# EAGLE design maddomat-slave (EAGLE 9.6.2)
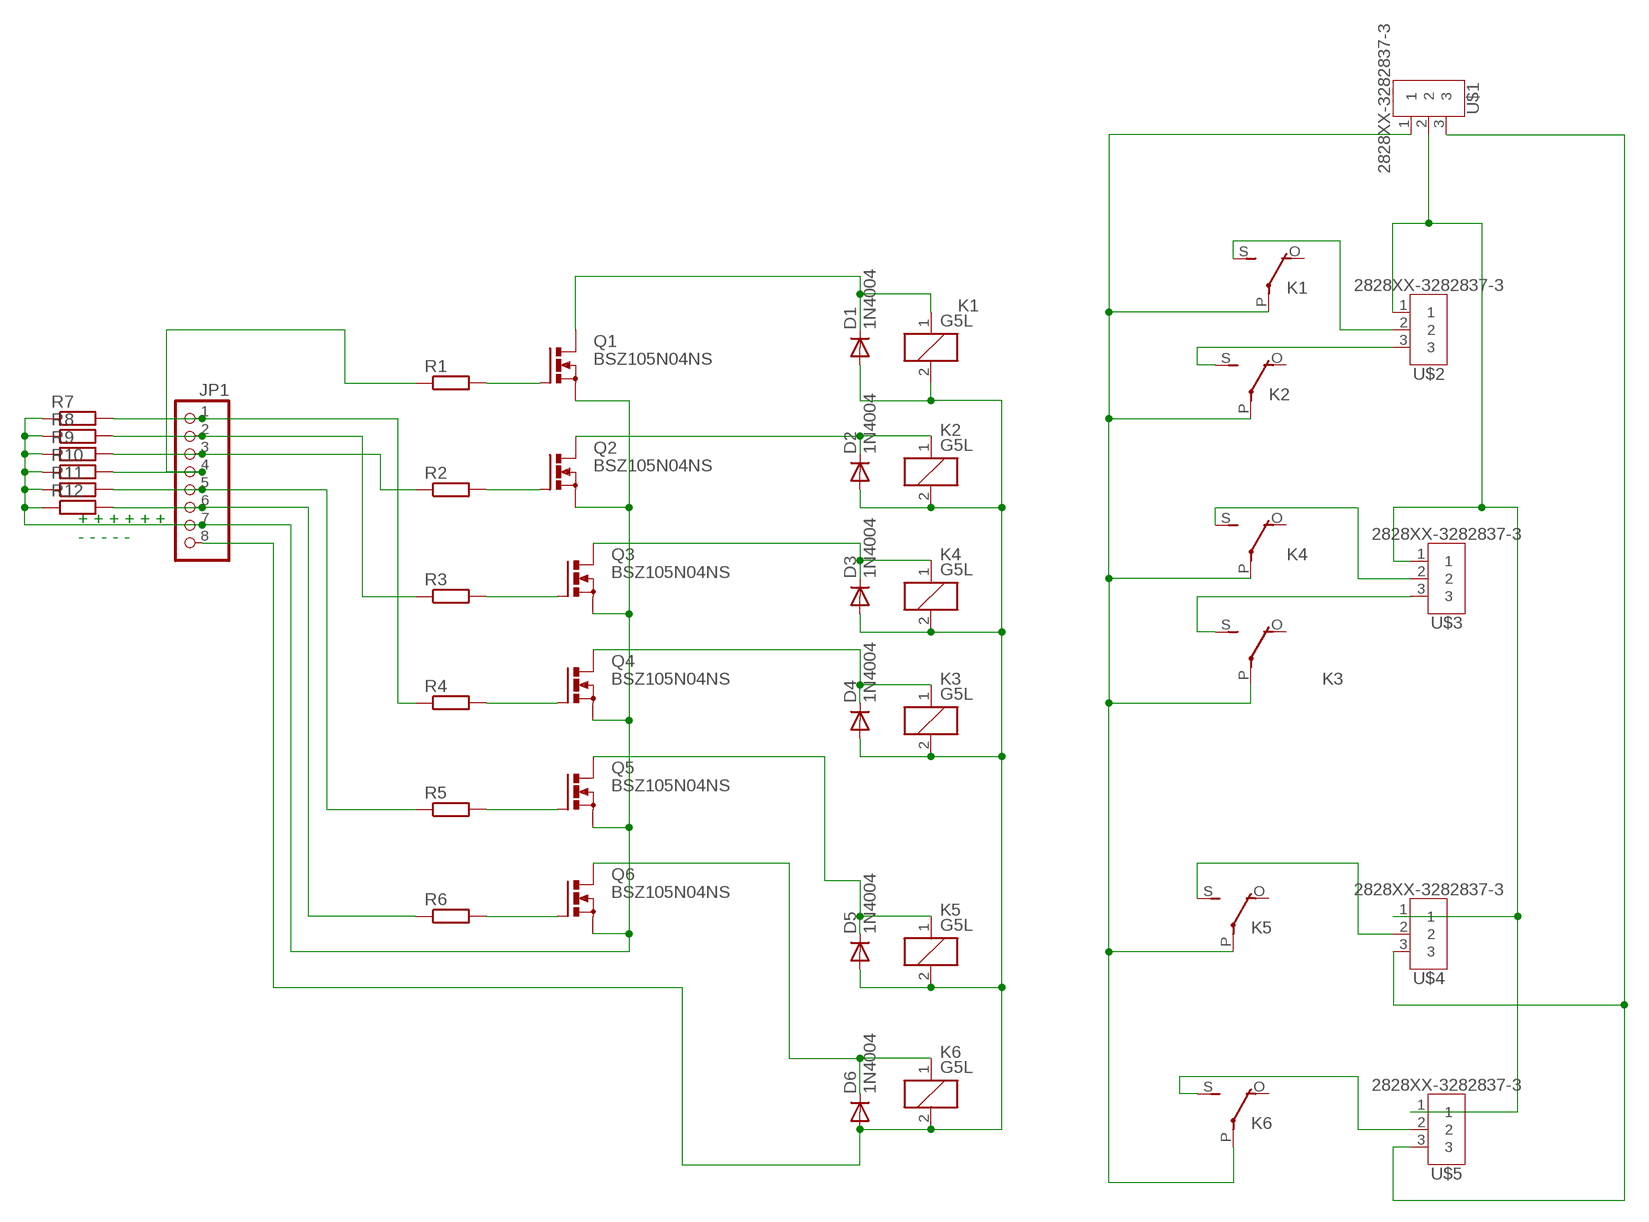
[diagram p0: schematic, sheet 1]

## Parts
D1  1N4004  [DO41-10]
D2  1N4004  [DO41-10]
D3  1N4004  [DO41-10]
D4  1N4004  [DO41-10]
D5  1N4004  [DO41-10]
D6  1N4004  [DO41-10]
JP1  PINHD-1X8  [1X08]
K1  G5L  [G5LE]
K2  G5L  [G5LE]
K3  G5L  [G5LE]
K4  G5L  [G5LE]
K5  G5L  [G5LE]
K6  G5L  [G5LE]
Q1  BSZ105N04NS  [PG-TDSON-8]
Q2  BSZ105N04NS  [PG-TDSON-8]
Q3  BSZ105N04NS  [PG-TDSON-8]
Q4  BSZ105N04NS  [PG-TDSON-8]
Q5  BSZ105N04NS  [PG-TDSON-8]
Q6  BSZ105N04NS  [PG-TDSON-8]
R1  R-EU_M0805  [M0805]
R2  R-EU_M0805  [M0805]
R3  R-EU_M0805  [M0805]
R4  R-EU_M0805  [M0805]
R5  R-EU_M0805  [M0805]
R6  R-EU_M0805  [M0805]
R7  R-EU_M0805  [M0805]
R8  R-EU_M0805  [M0805]
R9  R-EU_M0805  [M0805]
R10  R-EU_M0805  [M0805]
R11  R-EU_M0805  [M0805]
R12  R-EU_M0805  [M0805]
U$1  2828XX-3282837-3  [TERMBLK_508-3N]
U$2  2828XX-3282837-3  [TERMBLK_508-3N]
U$3  2828XX-3282837-3  [TERMBLK_508-3N]
U$4  2828XX-3282837-3  [TERMBLK_508-3N]
U$5  2828XX-3282837-3  [TERMBLK_508-3N]

## Nets
N$1: K1.S(2:S) U$2.2
N$2: K2.S(2:S) U$2.3
N$3: U$1.2 U$2.1 U$3.1 U$4.1 U$5.1
N$4: K4.S(2:S) U$3.2
N$5: K3.S(2:S) U$3.3
N$6: K5.S(2:S) U$4.2
N$7: K6.S(2:S) U$5.2
N$8: K1.P(2:P) K2.P(2:P) K3.P(2:P) K4.P(2:P) K5.P(2:P) K6.P(2:P) U$1.1
N$10: U$1.3 U$4.3 U$5.3
N$16: D1.C K1.1 Q1.5(D) Q1.6(D) Q1.7(D) Q1.8(D) Q1.TH(D)
N$17: JP1.4 R1.1 R10.2
N$18: JP1.3 R2.1 R9.2
N$19: JP1.2 R3.1 R8.2
N$20: JP1.1 R4.1 R7.2
N$21: JP1.5 R5.1 R11.2
N$22: JP1.6 R6.1 R12.2
N$23: Q1.4(G) R1.2
N$24: Q2.4(G) R2.2
N$25: Q3.4(G) R3.2
N$26: Q4.4(G) R4.2
N$27: Q5.4(G) R5.2
N$28: Q6.4(G) R6.2
N$32: JP1.7 Q1.1(S) Q1.2(S) Q1.3(S) Q2.1(S) Q2.2(S) Q2.3(S) Q3.1(S) Q3.2(S) Q3.3(S) Q4.1(S) Q4.2(S) Q4.3(S) Q5.1(S) Q5.2(S) Q5.3(S) Q6.1(S) Q6.2(S) Q6.3(S) R7.1 R8.1 R9.1 R10.1 R11.1 R12.1
N$36: D2.C K2.1 Q2.5(D) Q2.6(D) Q2.7(D) Q2.8(D) Q2.TH(D)
N$38: D3.C K4.1 Q3.5(D) Q3.6(D) Q3.7(D) Q3.8(D) Q3.TH(D)
N$39: D4.C K3.1 Q4.5(D) Q4.6(D) Q4.7(D) Q4.8(D) Q4.TH(D)
N$40: D5.C K5.1 Q5.5(D) Q5.6(D) Q5.7(D) Q5.8(D) Q5.TH(D)
N$41: D6.C K6.1 Q6.5(D) Q6.6(D) Q6.7(D) Q6.8(D) Q6.TH(D)
N$47: D1.A D2.A D3.A D4.A D5.A D6.A JP1.8 K1.2 K2.2 K3.2 K4.2 K5.2 K6.2
Unconnected: K1.O(2:O) K2.O(2:O) K3.O(2:O) K4.O(2:O) K5.O(2:O) K6.O(2:O)

## Notes on the sheet
- + + + + + +
- - - - - -

## Library data of the parts
D1-D6 = adafruit:1N4004: DIODE General purpose 1N400x type rectifier (With bigger pads) http://www.ladyada.net/library/pcb/eaglelibrary.html
JP1 = pinhead:PINHD-1X8: PIN HEADER
K1-K6 = relay:G5L: RELAY 1 x switch, 10 A/120 V AC, 8 A/30 V ADC, Omron; OC_FARNELL: unknown; OC_NEWARK: unknown
Q1-Q6 = transistor-power:BSZ105N04NS: OptiMOS (TM)3 Power-Transistor N-Channel, Normal level Source : Data sheet <http://www.infineon.com/dgdl/BSZ105N04NSG_rev1.1.pdf?folderId=db3a3043156fd5730115c7d50620107c&fileId=db3a30431689f4420116c485c67f084e>
R1-R12 = rcl_vlastni:R-EU_: RESISTOR, European symbol; SPICEPREFIX: R
U$1-U$5 = Connector:2828XX-3: 3 Position Wire to Board Terminal Block Horizontal with Board Datasheet <https://www.te.com.cn/commerce/DocumentDelivery/DDEController?Action=showdoc&DocId=Catalog+Section%7F1308389_EUROSTYLE_TERMINAL_BLOCKS%7F0607%7Fpdf%7FEnglish%7FENG_CS_1308389_EUROSTYLE_TERMINAL_BLOCKS_0607.pdf%7F2-282837-5>; CATEGORY: Connector; DESCRIPTION: TERM BLK 3P SIDE ENT 5.08mm PCB; MANUFACTURER: TE Connectivity; MPN: 282837-3; OPERATING_TEMPERATURE: -40°C to +105°C; PART_STATUS: Active; ROHS_COMPLIANCE: RoHS Compliant; SERIES: 282837; SUBCATEGORY: Terminal Block; TYPE: Side Wire Entry

## Board
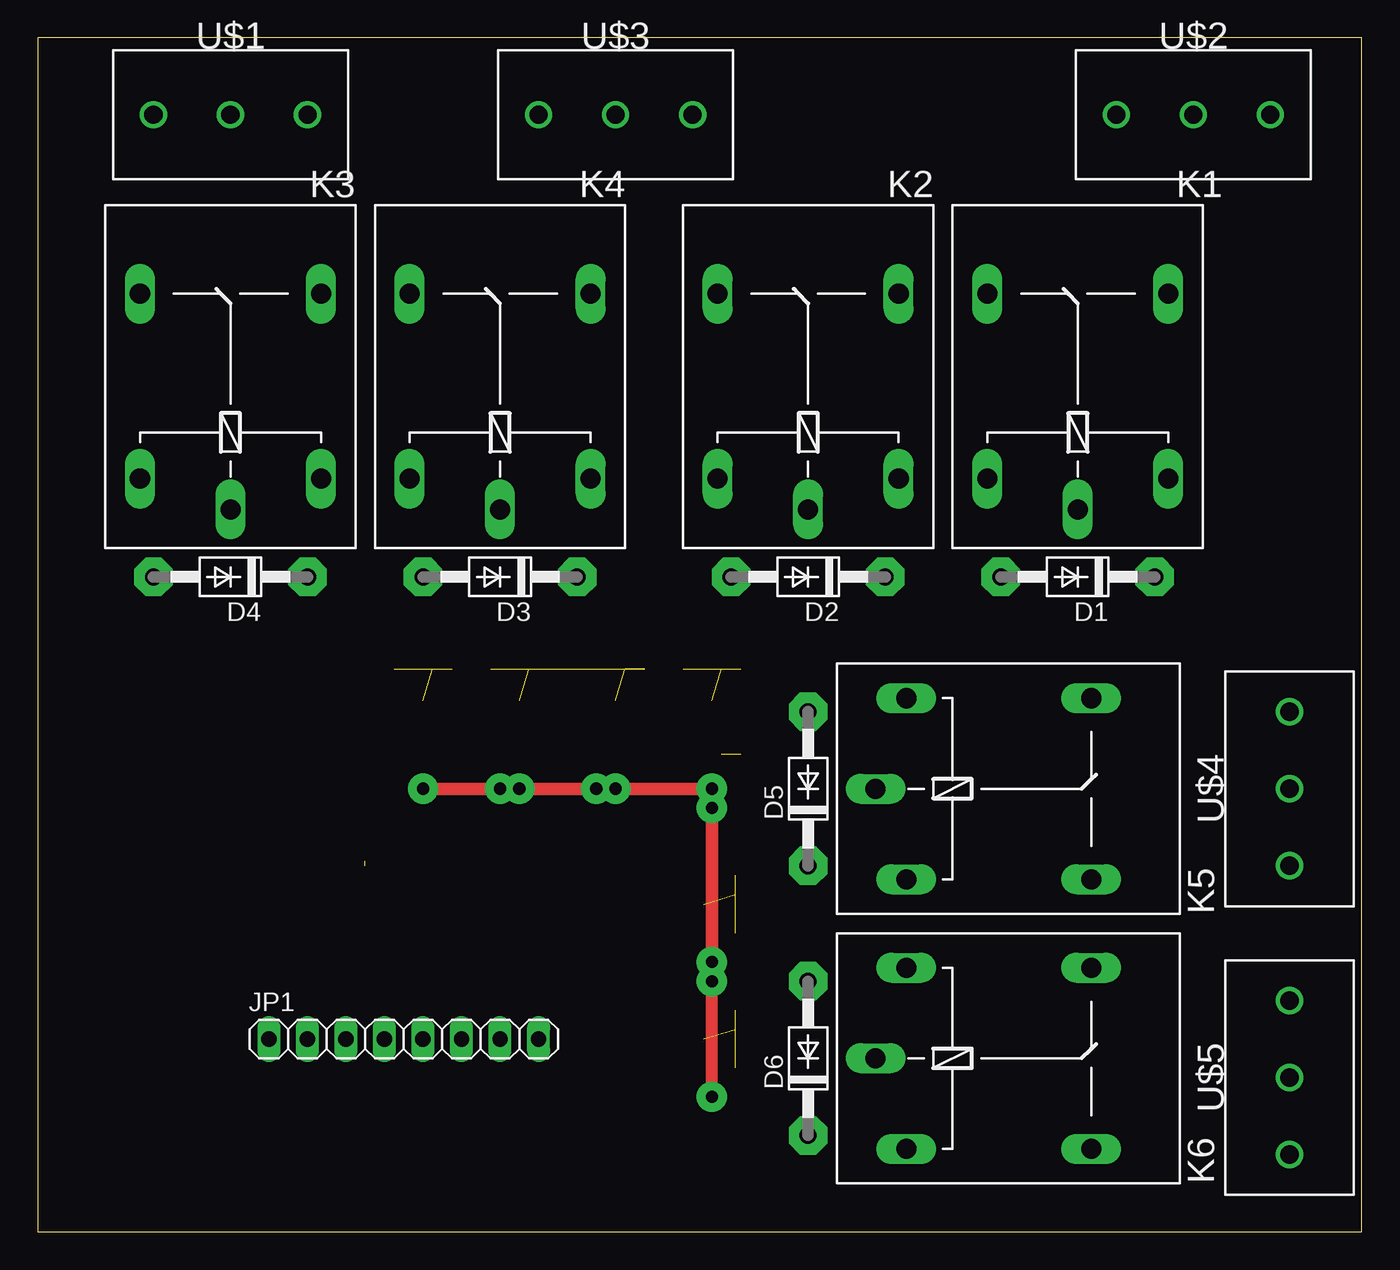
[diagram p1: board, top side]
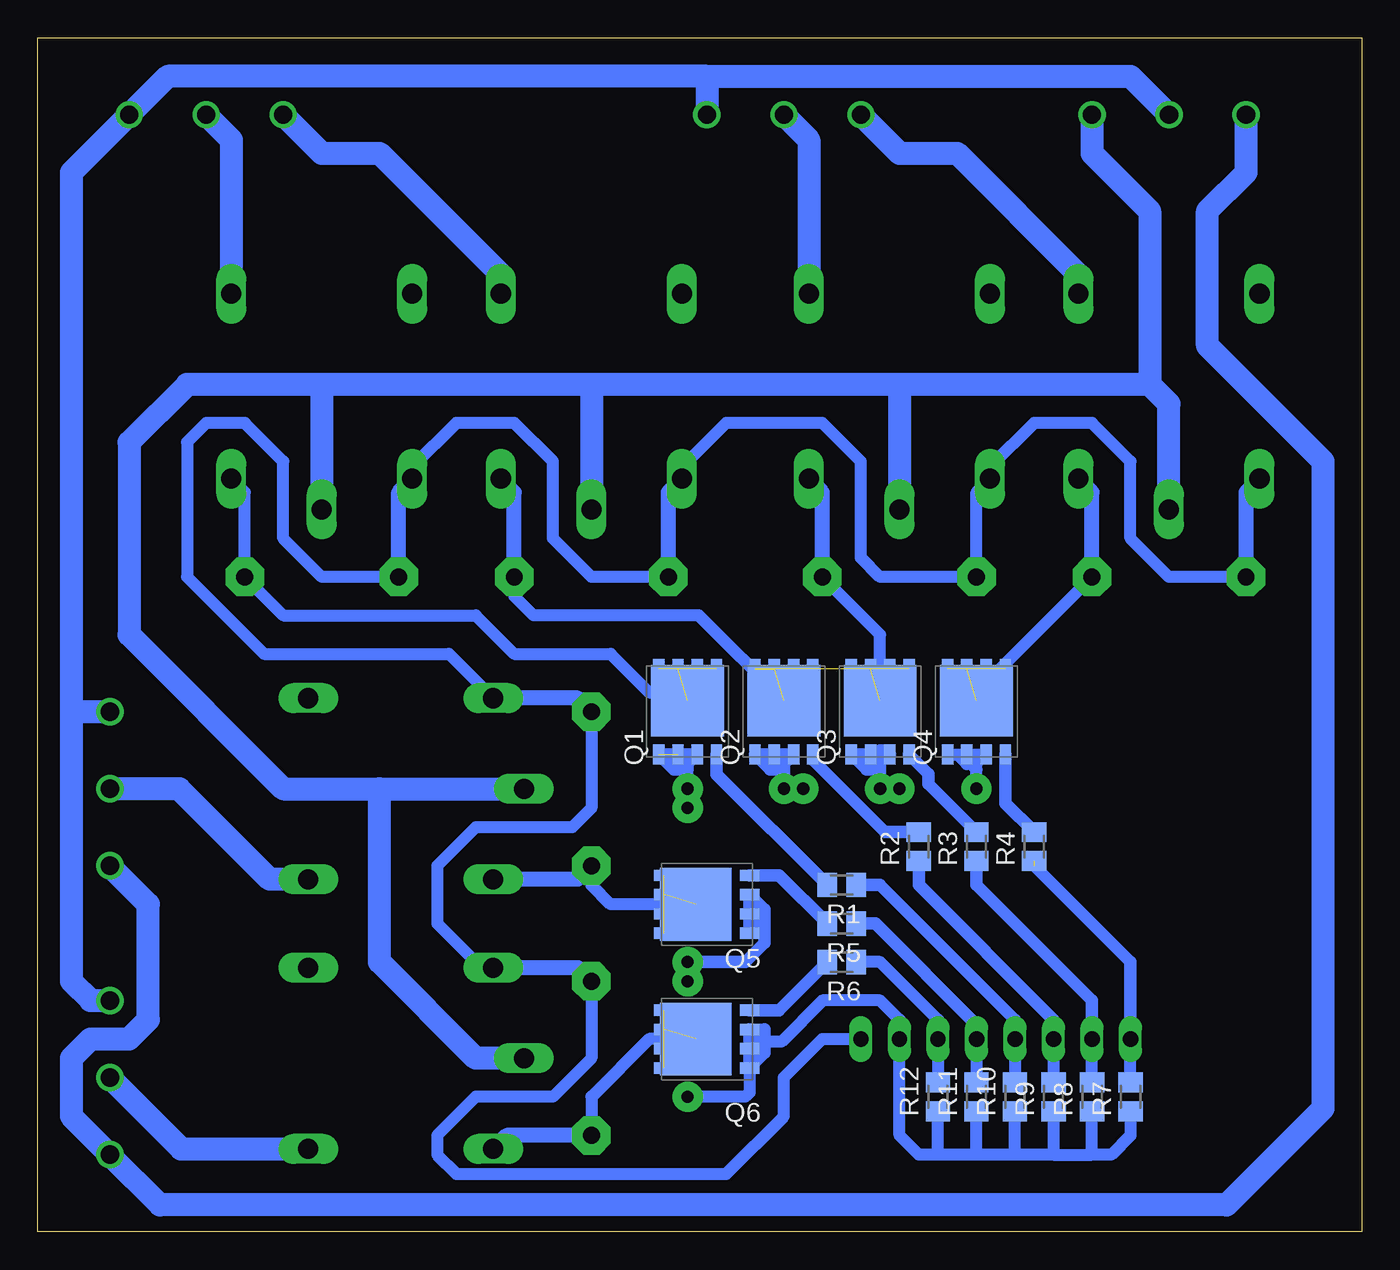
[diagram p2: board, bottom side, seen from below]

Size 87.3 x 78.73 mm. Coordinates in mm from the lower left corner, seen from the top.
Outline: 0,0 87.3,0 87.3,78.73 0,78.73 0,0
Copper layers (1*16): Top 0.035mm / dielectric 1.5mm / Bottom 0.035mm
Design rules "default": minimum track width 6mil, minimum drill 0.35mm, track to track 6mil, track to pad 6mil, pad to pad 6mil, via to via 6mil, smd to smd 6mil, copper to edge 40mil, drill to drill 6mil, minimum pad ring 10mil, minimum via ring 8mil, stop-mask expansion 4mil, vias tented up to drill 0mil, thermal gap 10mil

### Footprints (pad centres in the part's own frame; a part is rotated, then mirrored left to right if it is on the bottom)
DO41-10 = drill 1.118 pad 2.54 octagon: A 5.08,0; C -5.08,0
1X08 = drill 1.016 long: 1 -8.89,0; 2 -6.35,0; 3 -3.81,0; 4 -1.27,0; 5 1.27,0; 6 3.81,0; 7 6.35,0; 8 8.89,0
G5LE = drill 1.321 long: 1 -7.493,-5.969; 2 -7.493,5.969; O 4.699,5.969; P -9.525,0; S 4.699,-5.969
PG-TDSON-8 = smd 1.3 x 0.75: 1 -2.825,1.905; 2 -2.825,0.635; 3 -2.825,-0.635; 4 -2.825,-1.905; 5 2.825,-1.905; 6 2.825,-0.635; 7 2.825,0.635; 8 2.825,1.905 | smd 4.7 x 4.8: TH 0.725,0
M0805 = smd 1.3 x 1.6: 1 -0.95,0; 2 0.95,0
TERMBLK_508-3N = drill 1.2: 1 0,0; 2 5.08,0; 3 10.16,0

### Placement (x,y rotation side)
D1  68.58,43.18 180 top
D2  50.8,43.18 180 top
D3  30.48,43.18 180 top
D4  12.7,43.18 180 top
D5  50.8,29.21 90 top
D6  50.8,11.43 90 top
JP1  24.13,12.7 0 top
K1  68.58,57.15 90 top
K2  50.8,57.15 90 top
K3  12.7,57.15 90 top
K4  30.48,57.15 90 top
K5  64.77,29.21 0 top
K6  64.77,11.43 0 top
Q1  44.45,34.29 90 bottom
Q2  38.1,34.29 90 bottom
Q3  31.75,34.29 90 bottom
Q4  25.4,34.29 90 bottom
Q5  43.18,21.59 180 bottom
Q6  43.18,12.7 180 bottom
R1  34.29,22.86 180 bottom
R2  29.21,25.4 90 bottom
R3  25.4,25.4 90 bottom
R4  21.59,25.4 90 bottom
R5  34.29,20.32 180 bottom
R6  34.29,17.78 180 bottom
R7  15.24,8.89 90 bottom
R8  17.78,8.89 90 bottom
R9  20.32,8.89 90 bottom
R10  22.86,8.89 90 bottom
R11  25.4,8.89 90 bottom
R12  27.94,8.89 90 bottom
U$1  17.78,73.66 180 top
U$2  81.28,73.66 180 top
U$3  43.18,73.66 180 top
U$4  82.55,34.29 270 top
U$5  82.55,15.24 270 top

### Tracks (layer width: path | path; a pad name or v marks a point on that pad's centre or on a via)
N$1
  Bottom 1.5: U$2.2 74.55,72.01 K1.S
N$2
  Bottom 1.5: K2.S 56.77,63.12 64.77,71.12 68.58,71.12 U$2.3
N$3
  Bottom 1.5: 43.18,76.2 78.74,76.2 U$2.1 85.09,69.85 85.09,34.29 | 43.18,76.2 U$3.1 | 85.09,34.29 85.09,16.51 83.82,15.24 U$5.1 | 85.09,34.29 U$4.1 | 43.18,76.2 15.24,76.2 U$1.2
N$4
  Bottom 1.5: U$3.2 36.45,72.01 K4.S
N$5
  Bottom 1.5: K3.S 18.67,63.12 26.67,71.12 30.48,71.12 U$3.3
N$6
  Bottom 1.5: K5.S 72.01,23.24 77.98,29.21 U$4.2
N$7
  Bottom 1.5: U$5.2 77.85,5.46 K6.S
N$8
  Bottom 1.5: 30.48,55.88 50.8,55.88 | 50.8,55.88 68.58,55.88 | 68.58,55.88 K1.P 68.58,48.26 | 30.48,55.88 K4.P | 50.8,55.88 K2.P | 64.77,29.21 71.12,29.21 81.28,39.37 81.28,52.07 77.47,55.88 68.58,55.88 | K6.P 58.42,11.43 64.77,17.78 64.77,29.21 | 13.97,55.88 30.48,55.88 | 64.77,29.21 K5.P | U$1.1 17.78,71.12 13.97,67.31 13.97,55.88 | K3.P 12.7,54.61 13.97,55.88
N$9  (9 unrouted)
N$10
  Bottom 1.5: U$4.3 80.01,21.59 80.01,13.97 81.28,12.7 83.82,12.7 85.09,11.43 85.09,7.62 U$5.3 79.24,1.77 8.89,1.77 2.54,8.12 2.54,50.8 10.16,58.42 10.16,67.31 7.62,69.85 U$1.3
N$16  (4 unrouted)
  Bottom 0.8: Q1.TH 44.45,35.56 46.99,35.56 49.53,38.1 55.88,38.1 58.42,40.64 71.12,40.64 D1.C 73.66,48.77 K1.1
N$17
  Bottom 0.8: JP1.4 R10.2
  Bottom 0.813: R1.1 31.75,22.86 22.86,13.97 JP1.4
N$18
  Bottom 0.8: JP1.3 R9.2
  Bottom 0.813: JP1.3 20.32,13.97 29.21,22.86 R2.1
N$19
  Bottom 0.8: R8.2 JP1.2
  Bottom 0.813: JP1.2 17.78,15.24 25.4,22.86 R3.1
N$20  (1 unrouted)
  Bottom 0.8: R7.2 JP1.1
  Bottom 0.813: JP1.1 15.24,17.78 21.59,24.13
N$21
  Bottom 0.8: JP1.5 R11.2
  Bottom 0.813: R5.1 32.07,20.32 25.4,13.65 JP1.5
N$22
  Bottom 0.8: R6.1 31.75,17.78 27.94,13.97 JP1.6 R12.2
N$23
  Bottom 0.813: R1.2 42.55,30.16 Q1.4
N$24
  Bottom 0.813: R2.2 31.43,26.35 36.2,31.11 Q2.4
N$25
  Bottom 0.813: R3.2 28.57,29.52 28.57,30.2 Q3.4
N$26
  Bottom 0.813: Q4.4 23.5,28.25 R4.2
N$27
  Bottom 0.813: R5.2 38.42,23.5 Q5.4
N$28
  Bottom 0.813: Q6.4 38.42,14.61 R6.2
N$32  (via drill 0.8 pad 1.5, 0.8 pad 2)  (1 unrouted)
  Top 0.8: v44.45,8.89 v44.45,16.51
  Top 0.813: v44.45,16.51 v44.45,17.78 v44.45,27.94 | v44.45,29.21 v38.1,29.21 | v36.83,29.21 v31.75,29.21 | v30.48,29.21 v25.4,29.21
  Bottom 0.8: v25.4,29.21 25.4,30.48 | 25.4,30.48 25.4,30.83 | 26.67,31.46 Q4.2 | Q4.2 25.4,30.83 | Q4.2 Q4.3 | 25.4,30.83 26.04,30.83 26.67,31.46 | 26.67,31.46 Q4.1 26.39,31.46 25.4,30.48 | 39.37,21.24 Q5.3 Q5.1 | Q2.3 Q2.1 | Q6.1 40.36,9.18 40.64,8.89 v44.45,8.89 | 39.37,13.33 Q6.3 39.55,12.53 | 39.55,12.53 39.37,12.35 39.37,12.06 | 44.45,31.46 Q1.3 44.45,30.83 | 44.45,31.46 Q1.1 45.37,30.48 44.45,30.48 | v44.45,29.21 44.45,30.48 | 44.45,30.83 44.45,31.46 | 44.45,30.83 44.45,30.48 | 39.55,12.53 38.28,12.53 35.56,15.24 31.75,15.24 30.48,13.97 JP1.7 30.48,6.35 29.21,5.08 27.94,5.08 | 17.78,5.08 R8.1 | R9.1 20.32,5.08 | 20.32,5.08 17.78,5.08 | 20.32,5.08 22.86,5.08 | 22.86,5.08 R10.1 | 22.86,5.08 25.4,5.08 | 25.4,5.08 R11.1 | 25.4,5.08 27.94,5.08 | 27.94,5.08 R12.1 | R7.1 15.24,6.35 16.51,5.08 17.78,5.08 | Q5.2 39.72,20.32
  Bottom 0.813: Q6.2 39.37,12.06 | Q6.3 Q6.1 39.37,11.78 39.37,12.06 | 39.37,13.33 39.37,12.06 | v44.45,17.78 40.64,17.78 39.37,19.05 39.37,20.32 | 39.72,20.32 39.37,20.32 | 39.37,20.32 39.37,21.24 | 44.45,29.56 v44.45,29.21 v44.45,27.94 | 38.1,30.48 v38.1,29.21 v36.83,29.21 | 38.1,30.83 Q2.2 Q2.1 39.02,30.48 38.1,30.48 | Q2.3 38.1,30.83 | 38.1,30.83 38.1,30.48 | 31.75,30.48 v31.75,29.21 v30.48,29.21 | 31.75,30.48 31.75,31.75 31.4,31.75 Q3.3 | Q3.2 Q3.1 32.67,30.48 31.75,30.48
N$36  (4 unrouted)
  Bottom 0.8: Q2.TH 43.72,40.64 54.61,40.64 55.88,41.91 D2.C
  Bottom 1: D2.C 55.88,48.77 K2.1
N$38  (4 unrouted)
  Bottom 0.8: K4.1 36.83,50.04 36.83,50.8 | Q3.TH 31.75,39.37 D3.C
  Bottom 1: D3.C 35.56,48.77 K4.1
N$39  (4 unrouted)
  Bottom 0.8: K3.1 18.67,50.42 | 17.78,42.64 D4.C 25.4,35.56 Q4.TH
  Bottom 1: D4.C 17.78,48.77 K3.1
N$40  (4 unrouted)
  Bottom 0.8: D5.C 50.8,22.86 49.53,21.59 Q5.TH
  Bottom 1: D5.C 51.69,23.24 K5.1
N$41  (4 unrouted)
  Bottom 0.8: Q6.TH 46.99,12.7 50.8,8.89 D6.C
  Bottom 1: D6.C 56.39,6.35 K6.1
N$47
  Bottom 0.8: D4.A 12.7,43.18 15.24,45.72 15.24,50.8 17.78,53.34 21.59,53.34 24.51,50.42 K4.2 25.4,48.77 D3.A 31.75,43.18 33.02,44.45 33.02,50.8 35.56,53.34 41.91,53.34 44.83,50.42 K2.2 | D2.A 50.8,43.18 53.34,45.72 53.34,50.8 55.88,53.34 59.69,53.34 62.61,50.42 K1.2 | D1.A 68.58,43.18 71.12,45.72 71.12,50.8 73.66,53.34 76.2,53.34 77.47,52.07 77.47,43.18 72.39,38.1 60.2,38.1 K5.2 | D5.A 50.8,27.94 52.07,26.67 58.42,26.67 60.96,24.13 60.96,20.32 58.04,17.4 K6.2 | D6.A 50.8,11.43 53.34,8.89 58.42,8.89 60.96,6.35 60.96,5.08 59.69,3.81 41.91,3.81 38.1,7.62 38.1,10.16 35.56,12.7 JP1.8
  Bottom 0.813: K2.2 44.83,50.93 | K1.2 62.61,50.93
  Bottom 1: D5.A 51.69,35.18 K5.2 | D4.A 7.62,48.77 K3.2 | D2.A 45.72,48.77 K2.2 | D6.A 51.69,17.4 K6.2 | D1.A 63.5,48.77 K1.2